# EAGLE design DAC_TLV5636 (EAGLE 6.4)
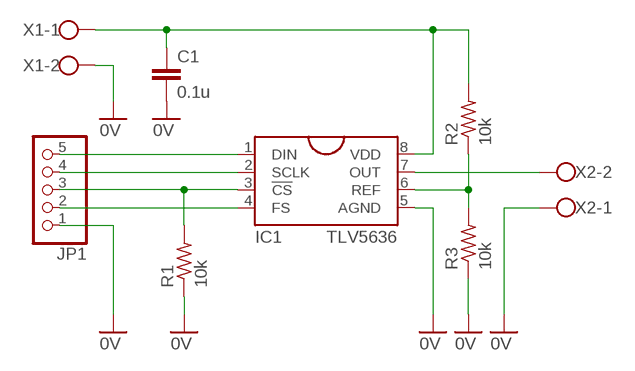
[diagram p0: schematic, sheet 1]

## Parts
C1  0.1u  C-EUC1206  [C1206]
IC1  TLV5636  [SOIC8]
JP1  PINHD-1X5  [1X05]
R1  10k  R-US_R0805  [R0805]
R2  10k  R-US_R0805  [R0805]
R3  10k  R-US_R0805  [R0805]
X1  W237-102  [W237-102]
X2  W237-102  [W237-102]

## Nets
0V: C1.2 IC1.5(AGND) JP1.1 R1.1 R3.1 X1.2 X2.1
N$1: IC1.4(FS) JP1.2
N$2: IC1.3(!CS!) JP1.3 R1.2
N$3: IC1.2(SCLK) JP1.4
N$4: IC1.1(DIN) JP1.5
N$5: IC1.6(REF) R2.1 R3.2
N$6: C1.1 IC1.8(VDD) R2.2 X1.1
N$7: IC1.7(OUT) X2.2

## Library data of the parts
C1 = rcl:C-EU: CAPACITOR, European symbol
IC1 = TLV5636:TLV5636
JP1 = pinhead:PINHD-1X5: PIN HEADER
R1-R3 = rcl:R-US_: RESISTOR, American symbol
X1 X2 = con-wago-500:W237-102: WAGO SCREW CLAMP; MPN: 237-102; OC_FARNELL: unknown; OC_NEWARK: 70K9898

## Board
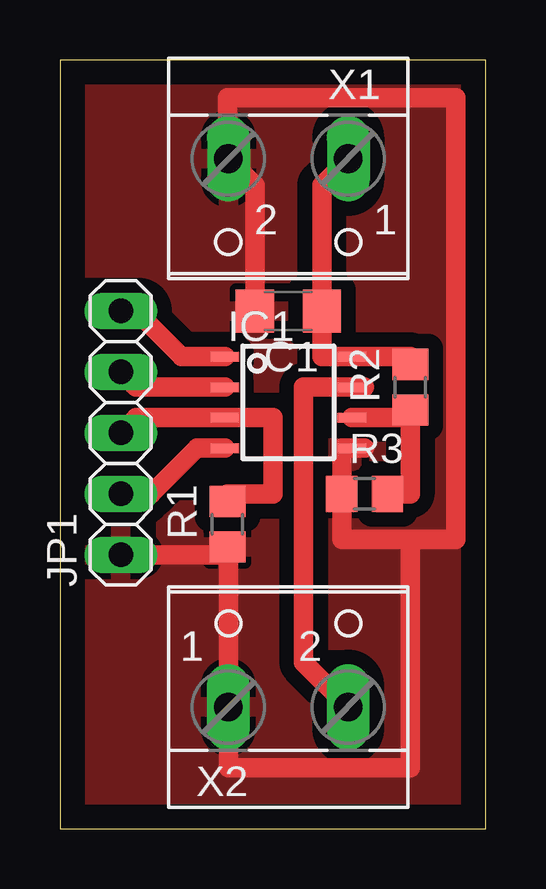
[diagram p1: board, top side]

Size 17.76 x 32.05 mm. Coordinates in mm from the lower left corner, seen from the top.
Outline: 0,0 17.76,0 17.76,32.05 0,32.05 0,0
Copper layers (1*16): Top 0.035mm / dielectric 1.5mm / Bottom 0.035mm
Design rules "default": minimum track width 10mil, minimum drill 24mil, track to track 8mil, track to pad 8mil, pad to pad 8mil, via to via 8mil, smd to smd 8mil, copper to edge 40mil, drill to drill 8mil, minimum pad ring 10mil, minimum via ring 8mil, stop-mask expansion 4mil, vias tented up to drill 0mil, thermal gap 10mil

### Footprints (pad centres in the part's own frame; a part is rotated, then mirrored left to right if it is on the bottom)
C1206 = smd 1.6 x 1.8: 1 -1.4,0; 2 1.4,0
SOIC8 = smd 0.4 x 1.2: 1 -1.905,-2.65; 2 -0.635,-2.65; 3 0.635,-2.65; 4 1.905,-2.65; 5 1.905,2.65; 6 0.635,2.65; 7 -0.635,2.65; 8 -1.905,2.65
1X05 = drill 1.016 long: 1 -5.08,0; 2 -2.54,0; 3 0,0; 4 2.54,0; 5 5.08,0
R0805 = smd 1.3 x 1.5: 1 -0.95,0; 2 0.95,0
W237-102 = drill 1.194 long: 1 -2.5,-1.27; 2 2.5,-1.27

### Placement (x,y rotation side)
C1  9.53,21.59 180 top
IC1  9.53,17.78 270 top
JP1  2.54,16.51 90 top
R1  6.99,12.7 90 top
R2  14.61,18.41 90 top
R3  12.7,13.97 0 top
X1  9.53,26.67 180 top
X2  9.53,6.35 0 top

### Tracks (layer width: path | path; a pad name or v marks a point on that pad's centre or on a via)
0V
  Top 0.813: C1.2 8.12,26.84 X1.2 6.99,27.94 6.99,30.48 16.51,30.48 16.51,12.06 14.61,12.06 | JP1.1 6.67,11.43 R1.1 7.03,11.71 X2.1 7.03,2.54 14.61,2.54 14.61,12.06 | 14.61,12.06 11.75,12.06 R3.1 11.75,15.88 IC1.5 12.7,15.88
  pour Top (isolate 0.61): 0,31.75 17.78,31.75 17.78,0 0,0
N$1
  Top 0.813: IC1.4 5.71,15.88 3.81,13.97 JP1.2
N$2
  Top 0.813: JP1.3 3.17,17.14 IC1.3 8.89,17.14 8.89,13.97 6.99,13.97 R1.2
N$3
  Top 0.813: IC1.2 3.17,18.41 JP1.4
N$4
  Top 0.813: IC1.1 5.08,19.68 3.17,21.59 JP1.5
N$5
  Top 0.813: IC1.6 14.29,17.14 R2.1 14.61,13.97 R3.2
N$6
  Top 0.813: X1.1 10.93,26.84 C1.1 10.93,19.68 IC1.8 14.61,19.68 R2.2
N$7
  Top 0.813: X2.2 10.16,6.95 10.16,18.41 IC1.7 12.7,18.41